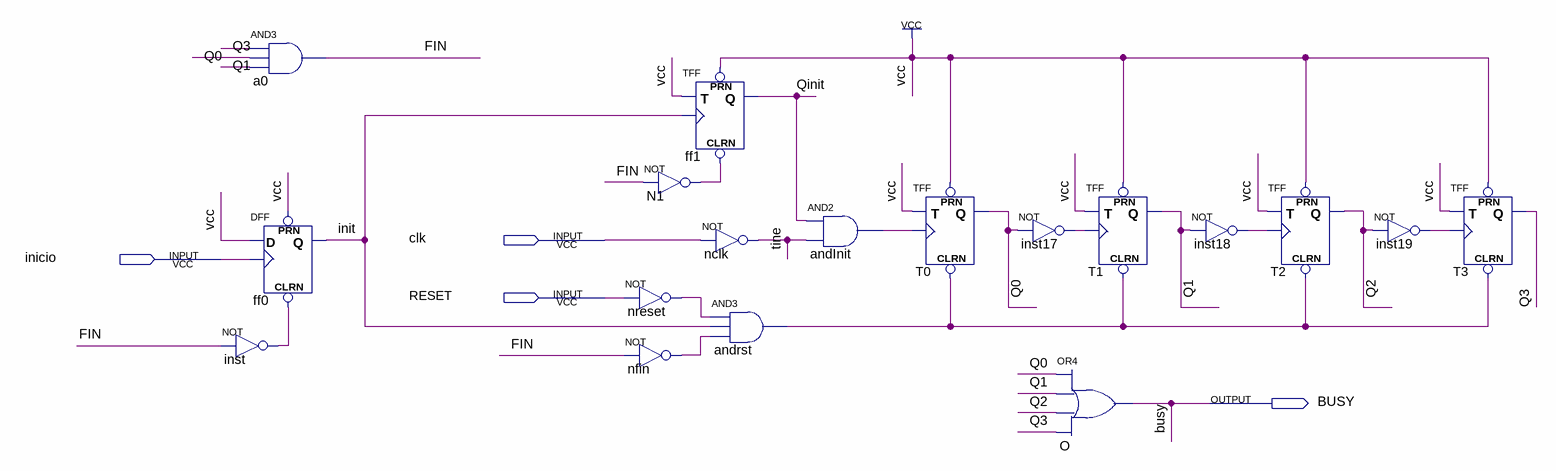
[diagram p0: schematic sheet]
// Quartus schematic Contador10.bdf as structural Verilog: 18 symbols, 4 pins
module Contador10 (
  input  clk,
  input  inicio,
  input  RESET,
  output BUSY
);

  wire andInit_out, andrst_out, FIN, init, inst17_out, inst18_out, inst19_out, inst_out, N1_out, nfin_out,
       nreset_out, Q0, Q1, Q2, Q3, Qinit, tine;

  not inst (inst_out, FIN);
  and a0 (FIN, Q3, Q0, Q1);
  DFF ff0 (.CLRN(inst_out), .CLK(inicio), .D(1'b1), .PRN(1'b1), .Q(init));
  TFF ff1 (.PRN(1'b1), .CLRN(N1_out), .T(1'b1), .CLK(init), .Q(Qinit));
  not N1 (N1_out, FIN);
  not nreset (nreset_out, RESET);
  not nfin (nfin_out, FIN);
  not nclk (tine, clk);
  and andrst (andrst_out, nreset_out, init, nfin_out);
  and andInit (andInit_out, Qinit, tine);
  TFF T0 (.PRN(1'b1), .CLRN(andrst_out), .T(1'b1), .CLK(andInit_out), .Q(Q0));
  not inst17 (inst17_out, Q0);
  or O (BUSY, Q0, Q1, Q2, Q3);
  TFF T1 (.PRN(1'b1), .CLRN(andrst_out), .T(1'b1), .CLK(inst17_out), .Q(Q1));
  not inst18 (inst18_out, Q1);
  TFF T2 (.PRN(1'b1), .CLRN(andrst_out), .T(1'b1), .CLK(inst18_out), .Q(Q2));
  not inst19 (inst19_out, Q2);
  TFF T3 (.PRN(1'b1), .CLRN(andrst_out), .T(1'b1), .CLK(inst19_out), .Q(Q3));
endmodule
